# EAGLE design programming (EAGLE 9.1.2)
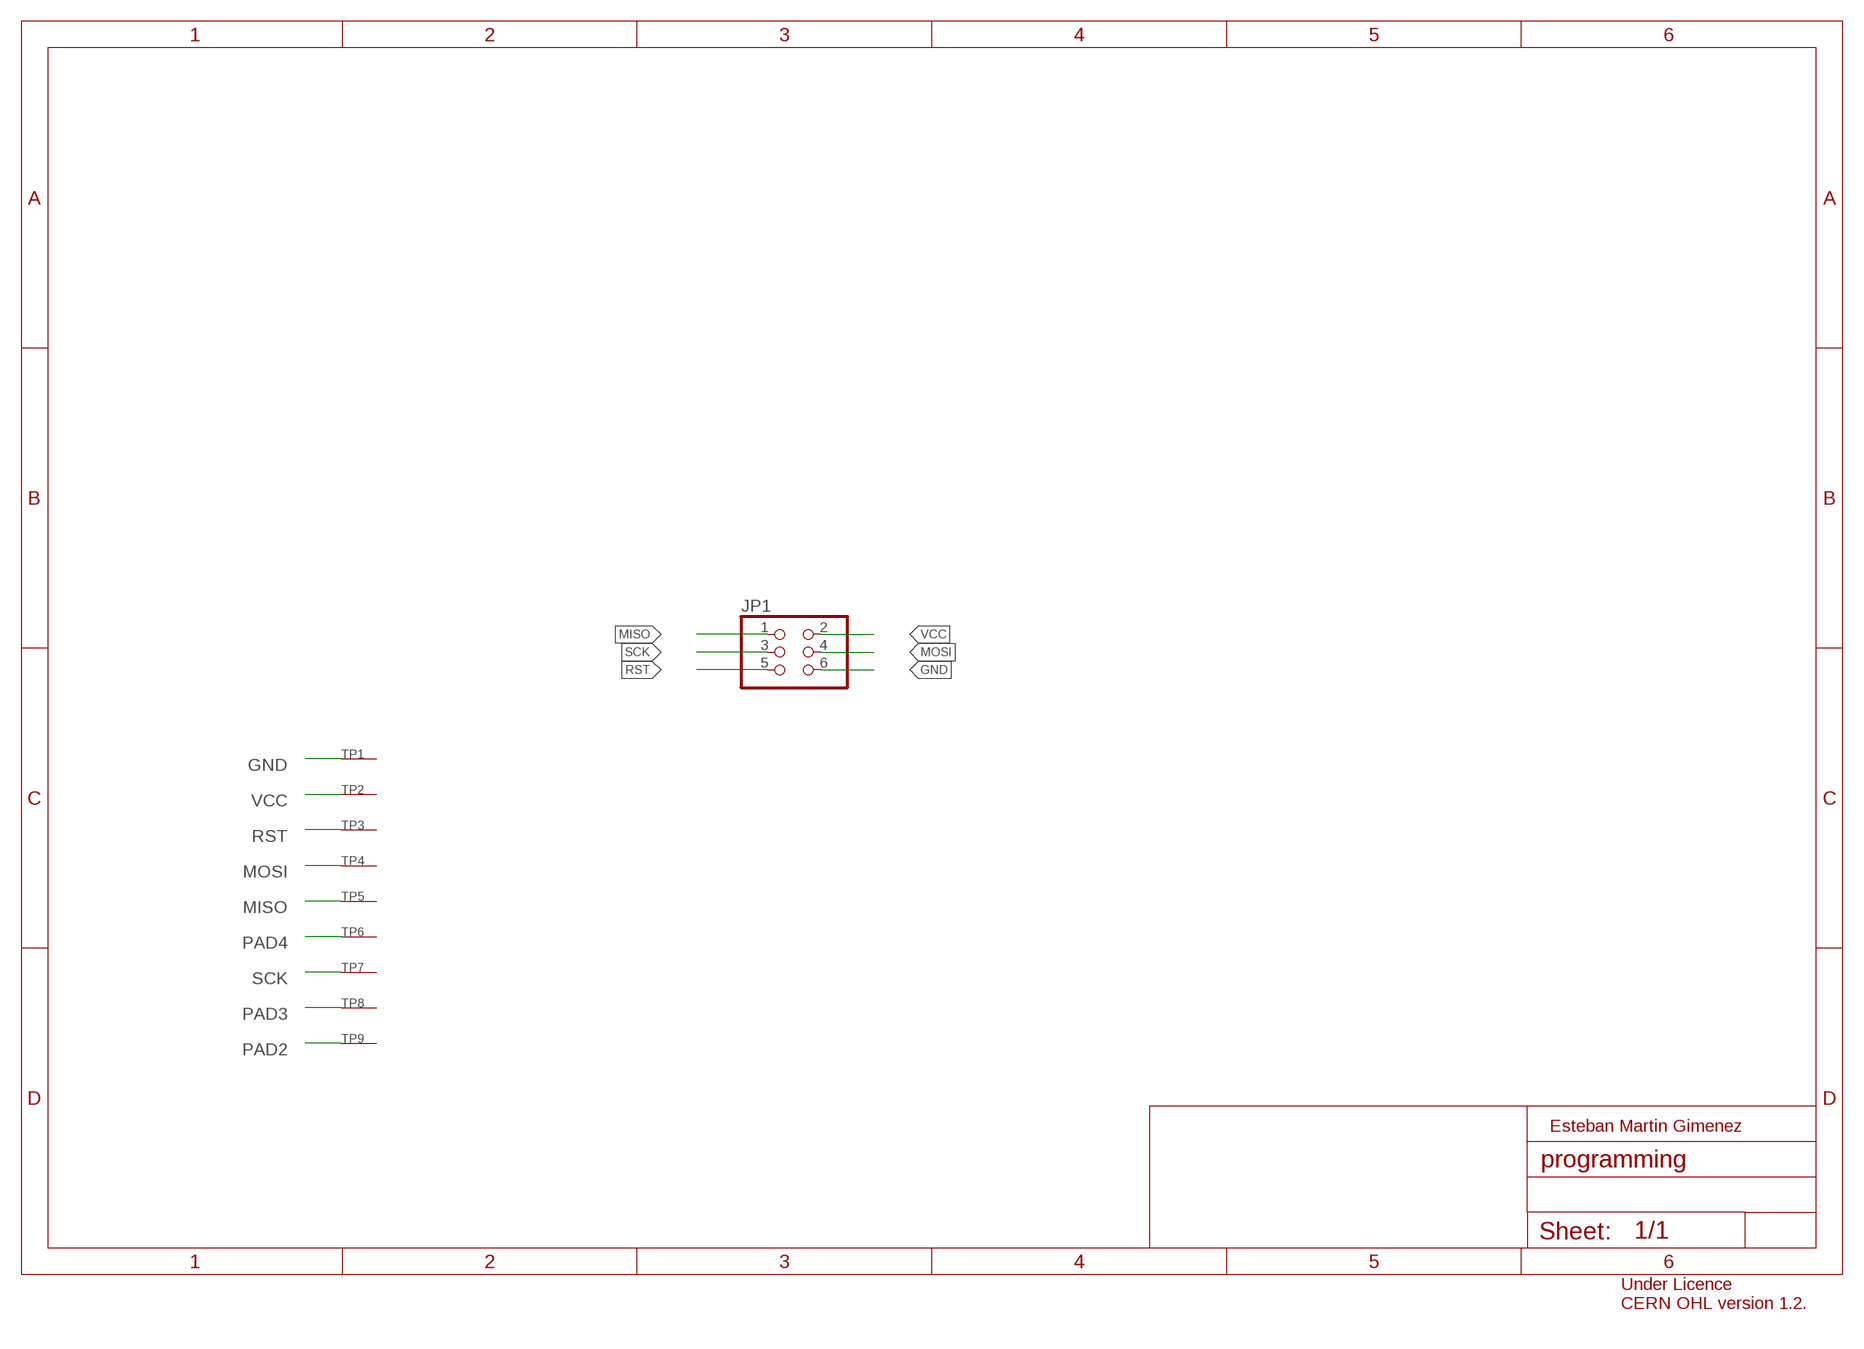
[diagram p0: schematic, sheet 1]

## Parts
JP1  PINHD-2X3-SMD  [2X03SMD]
TP1  SEWTAP-2.0IN  [SEWINGTAP_2.0]
TP2  SEWTAP-2.0IN  [SEWINGTAP_2.0]
TP3  SEWTAP-2.0IN  [SEWINGTAP_2.0]
TP4  SEWTAP-2.0IN  [SEWINGTAP_2.0]
TP5  SEWTAP-2.0IN  [SEWINGTAP_2.0]
TP6  SEWTAP-2.0IN  [SEWINGTAP_2.0]
TP7  SEWTAP-2.0IN  [SEWINGTAP_2.0]
TP8  SEWTAP-2.0IN  [SEWINGTAP_2.0]
TP9  SEWTAP-2.0IN  [SEWINGTAP_2.0]

## Nets
GND: JP1.6 TP1.P$1(SEW)
MISO: JP1.1 TP5.P$1(SEW)
MOSI: JP1.4 TP4.P$1(SEW)
PAD2: TP9.P$1(SEW)
PAD3: TP8.P$1(SEW)
PAD4: TP6.P$1(SEW)
RST: JP1.5 TP3.P$1(SEW)
SCK: JP1.3 TP7.P$1(SEW)
VCC: JP1.2 TP2.P$1(SEW)

## Notes on the sheet
- Esteban Martin Gimenez
- Under Licence 
  CERN OHL version 1.2.

## Library data of the parts
JP1 = fab:PINHD-2X3-SMD: PIN HEADER
TP1-TP9 = adafruit:SEWTAP

## Board
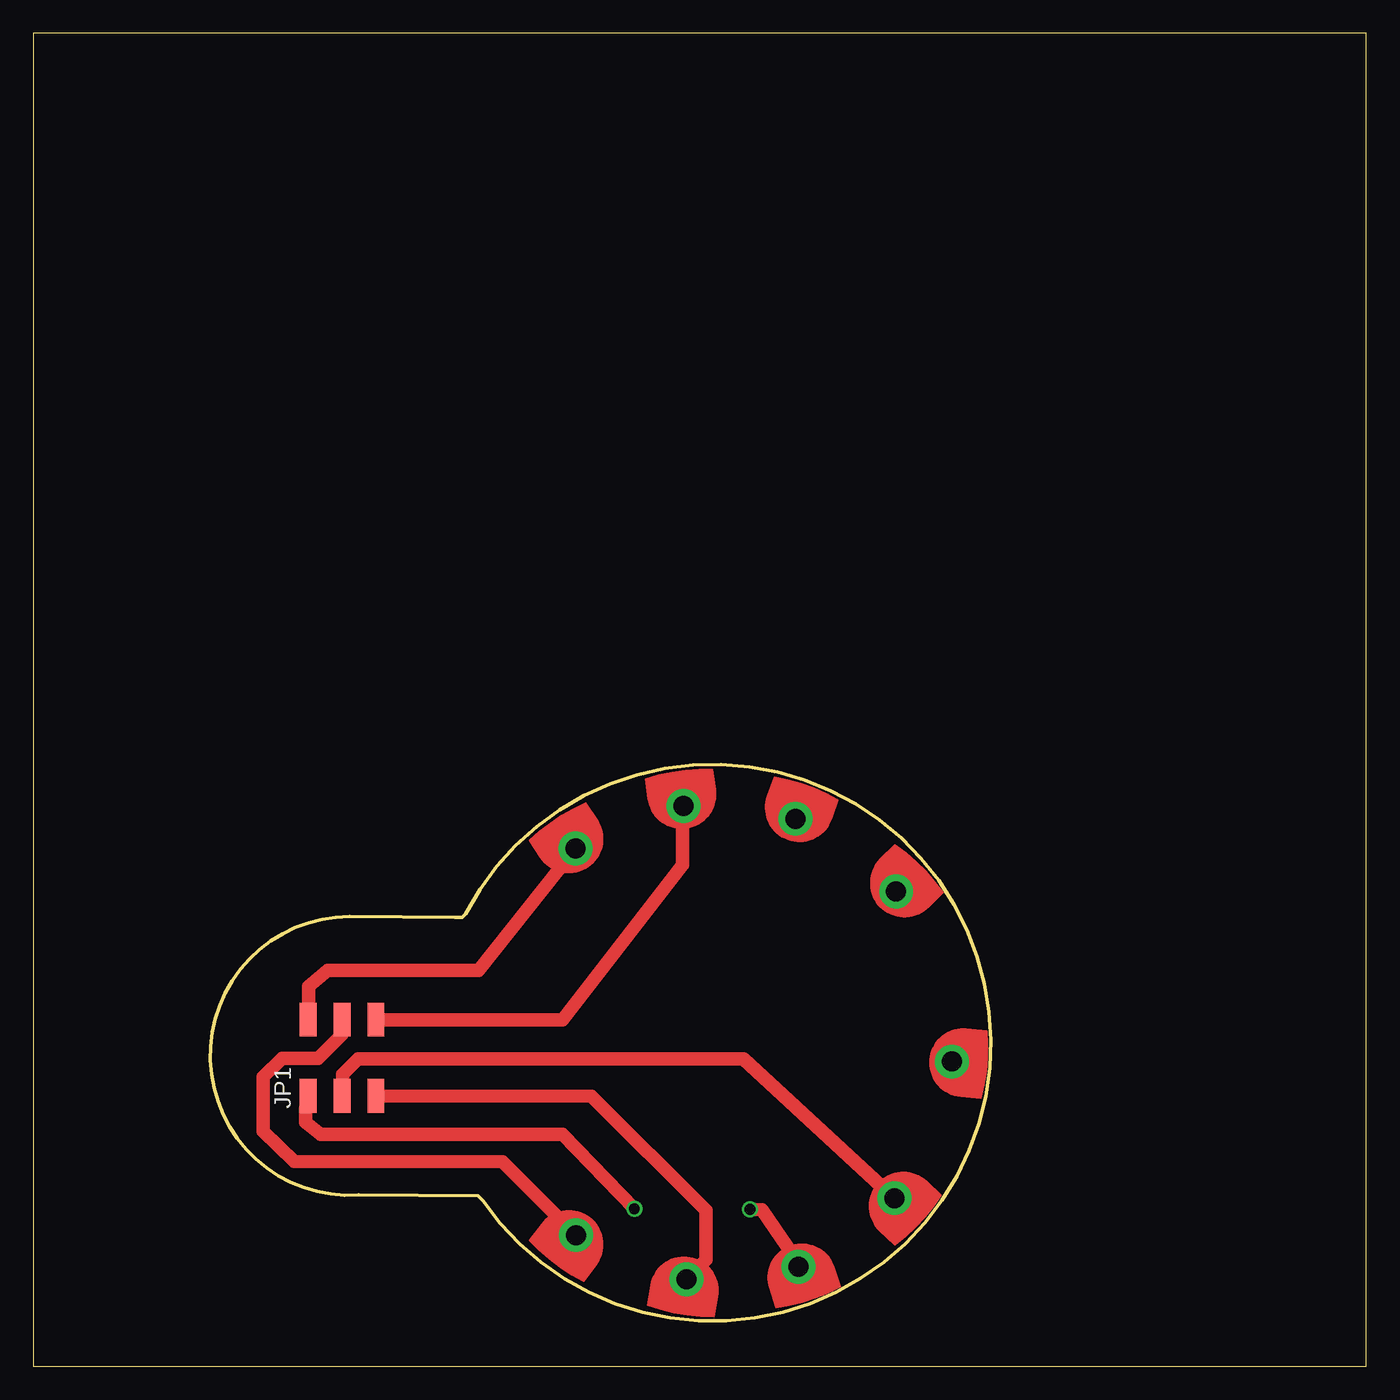
[diagram p1: board, top side]
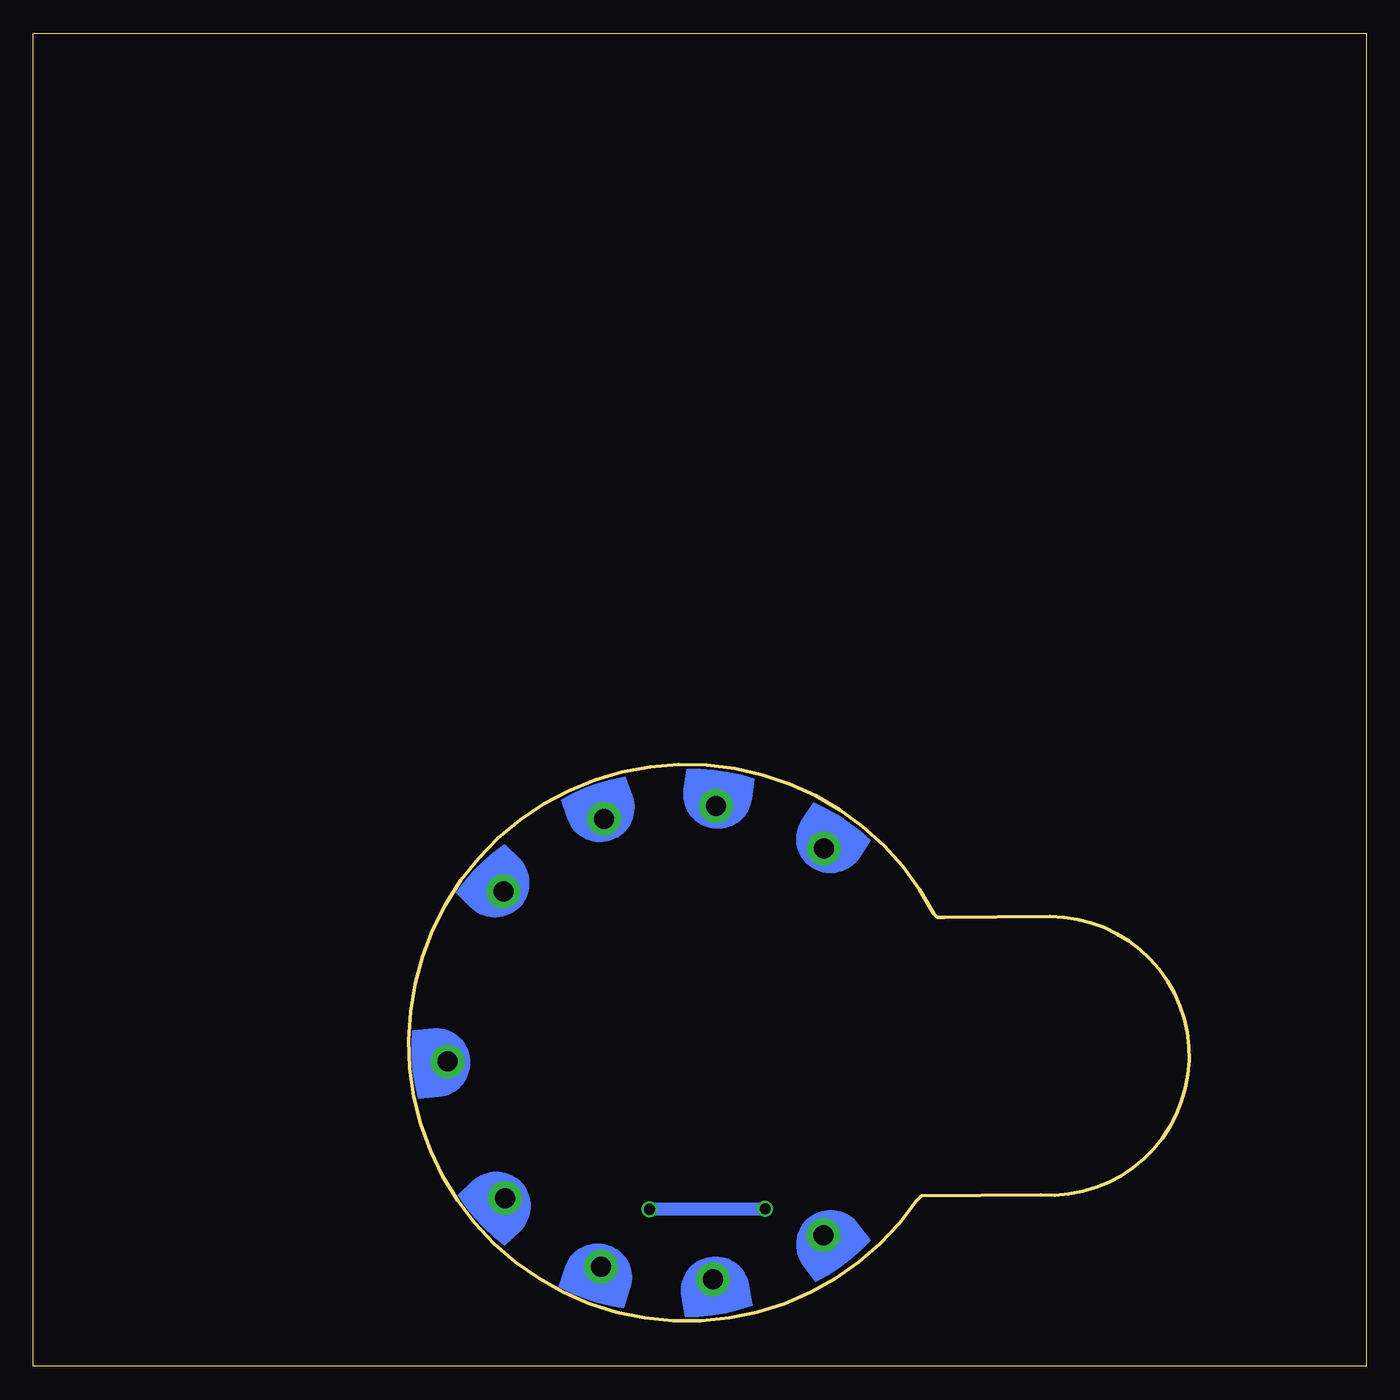
[diagram p2: board, bottom side, seen from below]

Size 100 x 100 mm. Coordinates in mm from the lower left corner, seen from the top.
Outline: 31.63,33.67 23.73,33.73 arc184 24.39,12.84 33.37,12.78 33.72,12.43
Outline: 31.68,33.66 32.17,33.66 32.44,33.93
Outline: 32.43,33.92 arc-298 33.74,12.42
Outline: 0,0 100,0 100,100 0,100 0,0
Copper layers (1*16): Top 0.035mm / dielectric 1.5mm / Bottom 0.035mm
Design rules "SeeedStudio_2layer_DRU_no_angle_20140221": minimum track width 6mil, minimum drill 12mil, track to track 6mil, track to pad 6mil, pad to pad 6mil, via to via 6mil, smd to smd 0mil, copper to edge 10mil, drill to drill 10mil, minimum pad ring 10mil, minimum via ring 6mil, stop-mask expansion 2mil, vias tented up to drill 100mil, thermal gap 10mil

### Footprints (pad centres in the part's own frame; a part is rotated, then mirrored left to right if it is on the bottom)
2X03SMD = smd 2.54 x 1.27: 1 -2.857,2.54; 2 2.857,2.54; 3 -2.857,0; 4 2.857,0; 5 -2.857,-2.54; 6 2.857,-2.54
SEWINGTAP_2.0 = drill 1.5 pad 2.54: P$1 0,0

### Placement (x,y rotation side)
JP1  23.16,23.14 90 top
TP1  48.77,42.03 8 top
TP2  40.68,38.84 33.8 top
TP3  49,6.52 170 top
TP4  40.72,9.84 217 bottom
TP5  57.39,7.46 198 top
TP6  68.92,22.85 265 top
TP7  64.61,12.61 227 top
TP8  64.73,35.62 315 top
TP9  57.17,41.07 340 top

### Tracks (layer width: path | path; a pad name or v marks a point on that pad's centre or on a via)
GND
  Top 1.016: JP1.6 39.71,26 48.72,37.61 48.72,41.97 TP1.P$1
MISO  (via drill 0.8)
  Top 1.016: JP1.1 20.48,20.66 20.44,18.3 21.56,17.39 39.72,17.39 v45.1,11.8 | v53.77,11.77 54.68,11.75 57.51,7.58 TP5.P$1
  Bottom 1.016: v45.1,11.8 v53.77,11.77
MOSI
  Top 1.016: JP1.4 23.11,24.85 21.39,23.08 18.66,23.09 17.25,21.69 17.25,17.63 19.55,15.36 35.22,15.34 TP4.P$1
RST
  Top 0.26: TP3.P$1 48.74,4.65
  Top 1.016: JP1.5 41.89,20.25 50.45,11.68 50.45,7.98 TP3.P$1
SCK
  Top 1.016: JP1.3 23.2,21.89 24.38,23.07 53.29,23.06 TP7.P$1
VCC
  Top 1.016: JP1.2 20.64,28.5 22.08,29.7 33.4,29.7 TP2.P$1